# Altium schematic sheet Motor.SchDoc
size A4; SheetNumber: 2; SheetTotal: 4
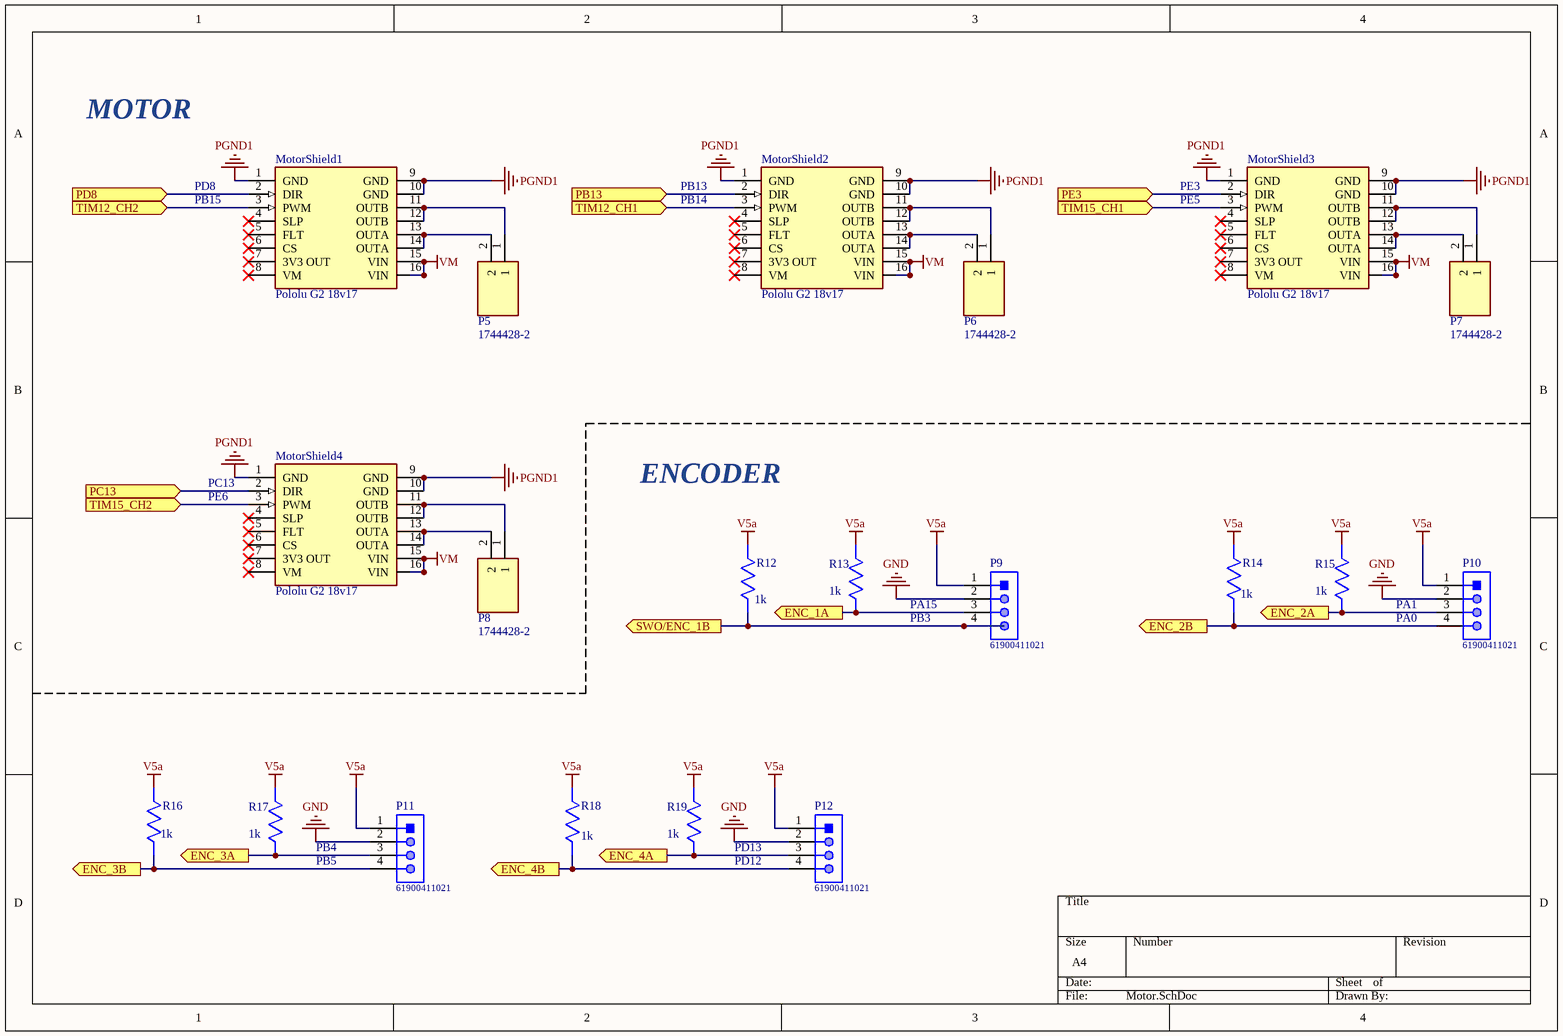
[diagram p0: Motor.SchDoc]

## Parts
MotorShield1  Pololu G2 18v17  [Pololu G218V17]
MotorShield2  Pololu G2 18v17  [Pololu G218V17]
MotorShield3  Pololu G2 18v17  [Pololu G218V17]
MotorShield4  Pololu G2 18v17  [Pololu G218V17]
P5  1744428-2  [17444282]
P6  1744428-2  [17444282]
P7  1744428-2  [17444282]
P8  1744428-2  [17444282]
P9  61900411021  [61900411021]
P10  61900411021  [61900411021]
P11  61900411021  [61900411021]
P12  61900411021  [61900411021]
R12  1k  [RESC1608X55N]
R13  1k  [RESC1608X55N]
R14  1k  [RESC1608X55N]
R15  1k  [RESC1608X55N]
R16  1k  [RESC1608X55N]
R17  1k  [RESC1608X55N]
R18  1k  [RESC1608X55N]
R19  1k  [RESC1608X55N]

## Ports
ENC_1A (out, see STM32[1C]), ENC_2A (out, see STM32[1B]), ENC_2B (out, see STM32[1B]), ENC_3A (out, see STM32[1C]), ENC_3B (out, see STM32[1C]), ENC_4A (out, see STM32[2D]), ENC_4B (out, see STM32[2D]), PB13 (in, see STM32[1D]), PC13 (in, see STM32[2C]), PD8 (in, see STM32[2D]), PE3 (in, see STM32[2A]), SWO/ENC_1B (out, see STM32[1C]), TIM12_CH1 (in, see STM32[1D]), TIM12_CH2 (in, see STM32[1D]), TIM15_CH1 (in, see STM32[2A]), TIM15_CH2 (in, see STM32[2A])

## Nets
GND: P9.2 P10.2 P11.2 P12.2
PGND1: MotorShield1.1(GND) MotorShield1.9(GND) MotorShield1.10(GND) MotorShield2.1(GND) MotorShield2.9(GND) MotorShield2.10(GND) MotorShield3.1(GND) MotorShield3.9(GND) MotorShield3.10(GND) MotorShield4.1(GND) MotorShield4.9(GND) MotorShield4.10(GND)
V5a: P9.1 P10.1 P11.1 P12.1 R12.2 R13.2 R14.2 R15.2 R16.2 R17.2 R18.2 R19.2
VM: MotorShield1.15(VIN) MotorShield1.16(VIN) MotorShield2.15(VIN) MotorShield2.16(VIN) MotorShield3.15(VIN) MotorShield3.16(VIN) MotorShield4.15(VIN) MotorShield4.16(VIN)
ENC_1A: P9.3 R13.1 ; port ENC_1A
ENC_2A: P10.3 R15.1 ; port ENC_2A
ENC_2B: P10.4 R14.1 ; port ENC_2B
ENC_3A: P11.3 R17.1 ; port ENC_3A
ENC_3B: P11.4 R16.1 ; port ENC_3B
ENC_4A: P12.3 R19.1 ; port ENC_4A
ENC_4B: P12.4 R18.1 ; port ENC_4B
PB13: MotorShield2.2(DIR) ; port PB13
PC13: MotorShield4.2(DIR) ; port PC13
PD8: MotorShield1.2(DIR) ; port PD8
PE3: MotorShield3.2(DIR) ; port PE3
SWO/ENC_1B: P9.4 R12.1 ; port SWO/ENC_1B
TIM12_CH1: MotorShield2.3(PWM) ; port TIM12_CH1
TIM12_CH2: MotorShield1.3(PWM) ; port TIM12_CH2
TIM15_CH1: MotorShield3.3(PWM) ; port TIM15_CH1
TIM15_CH2: MotorShield4.3(PWM) ; port TIM15_CH2
NetMotorShield1_11: MotorShield1.11(OUTB) MotorShield1.12(OUTB) P5.1
NetMotorShield1_13: MotorShield1.13(OUTA) MotorShield1.14(OUTA) P5.2
NetMotorShield2_11: MotorShield2.11(OUTB) MotorShield2.12(OUTB) P6.1
NetMotorShield2_13: MotorShield2.13(OUTA) MotorShield2.14(OUTA) P6.2
NetMotorShield3_11: MotorShield3.11(OUTB) MotorShield3.12(OUTB) P7.1
NetMotorShield3_13: MotorShield3.13(OUTA) MotorShield3.14(OUTA) P7.2
NetMotorShield4_11: MotorShield4.11(OUTB) MotorShield4.12(OUTB) P8.1
NetMotorShield4_13: MotorShield4.13(OUTA) MotorShield4.14(OUTA) P8.2

Not connected (* = marked no-connect by the designer): MotorShield1 4(SLP)* 5(FLT)* 6(CS)* 7(3V3_OUT)* 8(VM)*; MotorShield2 4(SLP)* 5(FLT)* 6(CS)* 7(3V3_OUT)* 8(VM)*; MotorShield3 4(SLP)* 5(FLT)* 6(CS)* 7(3V3_OUT)* 8(VM)*; MotorShield4 4(SLP)* 5(FLT)* 6(CS)* 7(3V3_OUT)* 8(VM)*

## Notes on the sheet
- MOTOR
- PB15
- PD8
- PB14
- PB13
- (near MotorShield3) PE5
- (near MotorShield3) PE3
- (near MotorShield4) PE6
- (near MotorShield4) PC13
- ENCODER
- PA15
- PB3
- PA1
- PA0
- PB4
- PD13
- PB5
- PD12

## Library data of the parts
MotorShield1-MotorShield4 = Pololu G2 18v17: DC Motor Driver
P5-P8 = 1744428-2: Connector; Manufacturer_Name: TE Connectivity; Datasheet Link: https://www.te.com/commerce/DocumentDelivery/DDEController?Action=srchrtrv&DocNm=1744428&DocType=Customer+Drawing&DocLang=English; Height: 8.8mm; Manufacturer_Part_Number: 1744428-2; Mouser Part Number: 571-1744428-2; Mouser Price/Stock: https://www.mouser.co.uk/ProductDetail/TE-Connectivity/1744428-2?qs=%2F6W%2F9%2FHWvcDoOfykajFB2Q%3D%3D
P9-P12 = CMP-1502-00594-1: Male Bottom Locking Header WR-WTB, THT, Right Angled, pitch 2.54 mm, 1 x 4 position; Manufacturer: Wurth Elektronik; Position: 1x4; Working Voltage: 250VAC; Pitch: 2.54mm; Contact Resistance: 20mOhm; Part Number: 61900411021; Operating Temperature: -40to105degC; Orientation: RightAngled; Packaging: Bag; Datasheet URL: https://katalog.we-online.de/em/datasheet/6190xx11021.pdf; Package Reference: 61900411021; Publisher: WurthElektronik; Mounting Technology: THT; Manufacturer URL: http://www.we-online.de; Gender: Male
R12-R19 = CMP0603-FX-1003ELF: Resistor; Manufacturer_Name: Bourns; Datasheet Link: https://www.mouser.co.uk/datasheet/2/54/Bourns_CMP_Datasheet_05.28.20-1854233.pdf; Height: 0.55mm; Manufacturer_Part_Number: CMP0603-FX-1003ELF